# Altium schematic sheet MCU.SchDoc
size A
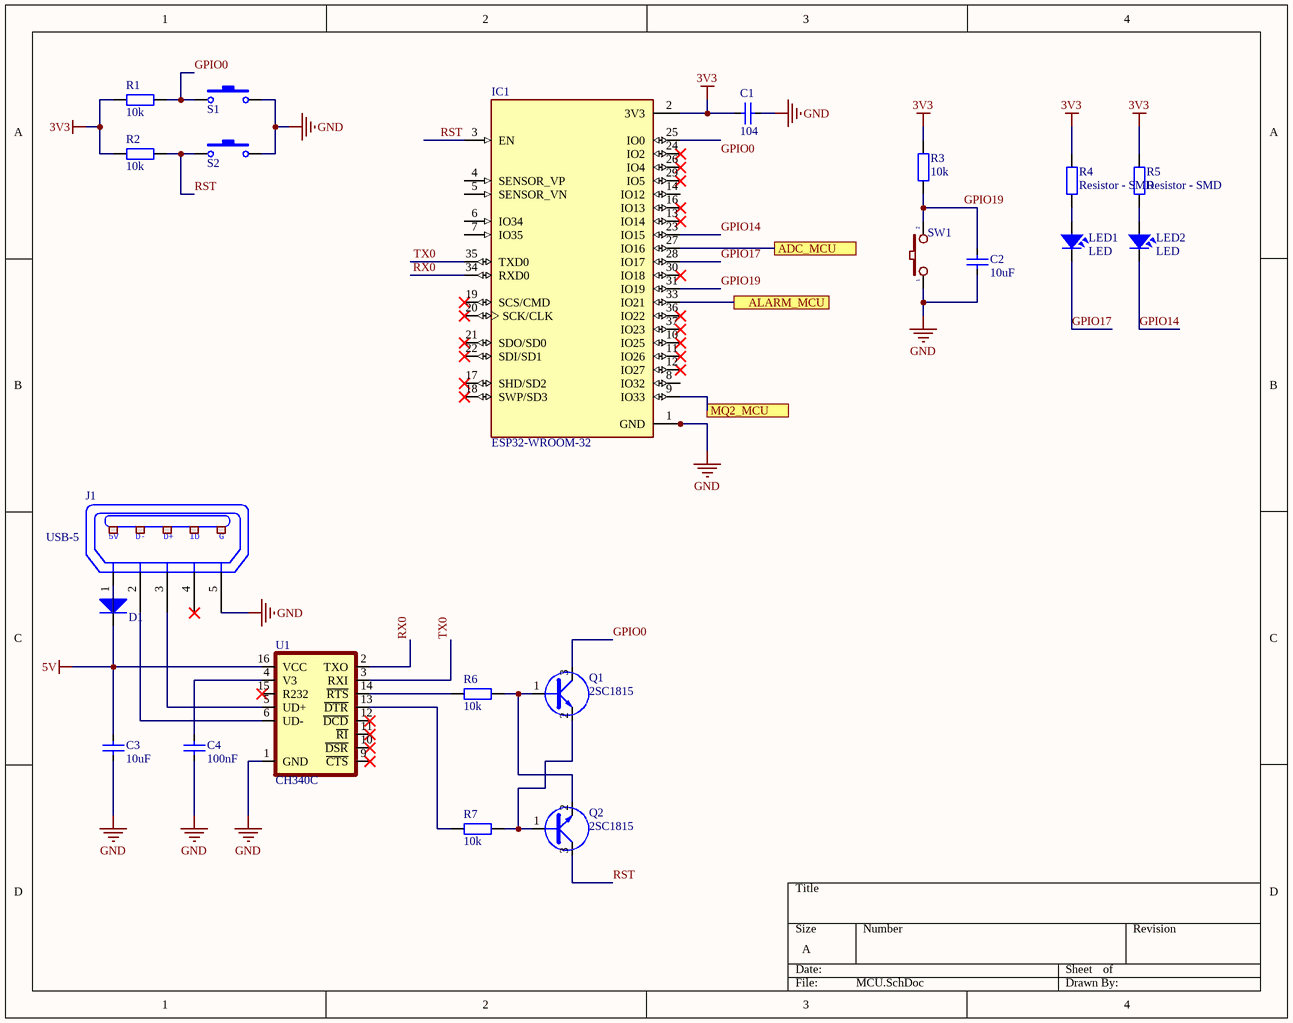
[diagram p0: MCU.SchDoc]

## Parts
C1  104  [CAP_0805]
C2  10uF  [CAP_0805]
C3  10uF  [CAP_0805]
C4  100nF  [CAP_0805]
D1  Diode SMD  [DIO-214AC(SMA)]  (value not drawn)
IC1  ESP32-WROOM-32  [MODULE_ESP32-WROOM-32]
J1  USB-5  [USB-M1]
LED1  LED  [LED-0805-Blue]
LED2  LED  [LED-3]
Q1  2SC1815  [SOT23D]
Q2  2SC1815  [SOT23D]
R1  10k  [RES-SMD-0805]
R2  10k  [RES-SMD-0805]
R3  10k  [RES-SMD-0805]
R4  Resistor - SMD  [RES-SMD-0805]
R5  Resistor - SMD  [RES-SMD-0805]
R6  10k  [RES-SMD-0805]
R7  10k  [RES-SMD-0805]
S1  SW-SMD  [SW 3x2x4]  (value not drawn)
S2  SW-SMD  [SW 3x2x4]  (value not drawn)
SW1  SW  [SW2]  (value not drawn)
U1  CH340C  [SOP-16]

## Ports
ADC_MCU, ALARM_MCU, MQ2_MCU

## Nets
3V3: C1.1 IC1.2(3V3) R1.2 R2.2 R3.1 R4.2 R5.2
5V: C3.2 D1.2(K) U1.16(VCC)
GND: C1.2 C2.1 C3.1 C4.1 IC1.1(GND) IC1.15(GND) IC1.38(GND) IC1.39_1(GND) IC1.39_2(GND) IC1.39_3(GND) IC1.39_4(GND) IC1.39_5(GND) IC1.39_6(GND) IC1.39_7(GND) IC1.39_8(GND) IC1.39_9(GND) IC1.39_10(GND) IC1.39_11(GND) IC1.39_12(GND) IC1.39_13(GND) IC1.39_14(GND) IC1.39_15(GND) IC1.39_16(GND) IC1.39_17(GND) IC1.39_18(GND) IC1.39_19(GND) IC1.39_20(GND) IC1.39_21(GND) J1.5(P5) S1.2 S2.2 SW1.1 U1.1(GND)
ADC_MCU: IC1.27(IO16) ; port ADC_MCU
ALARM_MCU: IC1.33(IO21) ; port ALARM_MCU
GPIO0: IC1.25(IO0) Q1.3(C) R1.1 S1.1
GPIO14: IC1.23(IO15) LED2.2
GPIO17: IC1.28(IO17) LED1.2
GPIO19: C2.2 IC1.31(IO19) R3.2 SW1.2
MQ2_MCU: IC1.9(IO33) ; port MQ2_MCU
RST: IC1.3(EN) Q2.3(C) R2.1 S2.1
RX0: IC1.34(RXD0) U1.2(TXO)
TX0: IC1.35(TXD0) U1.3(RXI)
NetC4_2: C4.2 U1.4(V3)
NetD1_1: D1.1(A) J1.1(P1)
NetJ1_2: J1.2(P2) U1.6(UD-)
NetJ1_3: J1.3(P3) U1.5(UD+)
NetLED1_1: LED1.1 R4.1
NetLED2_1: LED2.1 R5.1
NetQ1_1: Q1.1(B) Q2.2(E) R6.1
NetQ1_2: Q1.2(E) Q2.1(B) R7.1
NetR6_2: R6.2 U1.14(~{RTS})
NetR7_2: R7.2 U1.13(~{DTR})

Not connected (* = marked no-connect by the designer): IC1 4(SENSOR_VP) 5(SENSOR_VN) 6(IO34) 7(IO35) 8(IO32) 10(IO25)* 11(IO26)* 12(IO27)* 13(IO14)* 14(IO12) 16(IO13)* 17(SHD/SD2)* 18(SWP/SD3)* 19(SCS/CMD)* 20(SCK/CLK)* 21(SDO/SD0)* 22(SDI/SD1)* 24(IO2)* 26(IO4)* 29(IO5)* 30(IO18)* 36(IO22)* 37(IO23)*; J1 4(P4)*; U1 9(~{CTS})* 10(~{DSR})* 11(~{RI})* 12(~{DCD})* 15(R232)*

## Notes on the sheet
- (in symbol USB-5) 5V; D-; D+; ID; G

## Library data of the parts
C1-C4 = CapSMD: Capacitor; Value: 33p; Published: 8-Jun-2000; LatestRevisionDate: 17-Jul-2002; LatestRevisionNote: Re-released for DXP Platform.; PackageReference: RAD-0.3; Publisher: Altium Limited
D1 = Diode SMD: Default Diode; Code - JEDEC: DO-214-AB; Value: 1N5007; Published: 8-Jun-2000; Revision: July-2002: Re-released for DXP Platform.; Publisher: Altium Limited
IC1 = ESP32-WROOM-32: Bluetooth, WiFi Transceiver Module 2.4GHz ~ 2.5GHz Surface Mount; MF: Espressif Systems; Package: Module Espressif Systems; Digi-Key_Part_Number: 1904-1010-1-ND; Digi-Key_Purchase_URL: https://www.digikey.com/product-detail/en/espressif-systems/ESP32-WROOM-32/1904-1010-1-ND/8544305?utm_source=snapeda&utm_medium=aggregator&utm_campaign=symbol; Value: *; MP: ESP32-WROOM-32; SnapEDA_Link: https://www.snapeda.com/parts/ESP32-WROOM-32/Espressif%20Systems/view-part/2753322/?ref=snap
J1 = USB-5: Manufacturer: FCI; Manufacturer Part Number: 10118193-0001LF; Connector Type: USB - micro B; Number of Contacts: 5; Gender: Receptacle; Specifications: USB 2.0; .Creator: MM; .Checked PCB: RF; Supplier 1: Digi-Key; RoHS: RoHS Compliant; Category: Connectors, Interconnects; Stock 1: 28642; Pricing 1: 1=0.46, 10=0.433, 25=0.3712, 50=0.3156, 100=0.3032, 250=0.27224, 500=0.25988 (USD); Packaging: Cut Tape (CT); Mounting Type: Surface Mount, Right Angle, Horizontal; Features: Shielded, Solder Retention; Ingress Protection: -; ComponentLink1URL: http://portal.fciconnect.com/Comergent//fci/drawing/10118193.pdf; ComponentLink1Description: http://portal.fciconnect.com/Comergent//fci/drawing/10118193.pdf; Supplier Part Number 1: 609-4616-1-ND; .Checked SCH: MM
LED1 LED2 = LED: LED Single colour Green and Red; Value: LED 3 ly Single Colour
Q1 Q2 = C1815: NPN 600mW, ECB; Value: C1815
R1-R7 = Resistor - SMD: Resistor SMD; Manufacturer: Generic Components; Class: Passive; Published: 08/06/2000; Publisher: Altium Hobart Technology Centre
S1 S2 = SW-SMD: Switch; Published: 24-Mar-1999; LatestRevisionDate: 17-Jul-2002; LatestRevisionNote: Re-released for DXP Platform.; PackageReference: SPST-2; Publisher: Altium Limited
SW1 = SW2: Switch button 2 pin; Value: SW chip 2 pin
U1 = CH340C: USB to serial chip CH340; MF: WCH; Package: Package; Check_prices: https://www.snapeda.com/parts/CH340C/WCH/view-part/5428851/?ref=eda; Value: *; Price: None; MP: CH340C; Availability: Unavailable; SnapEDA_Link: https://www.snapeda.com/parts/CH340C/WCH/view-part/5428851/?ref=snap